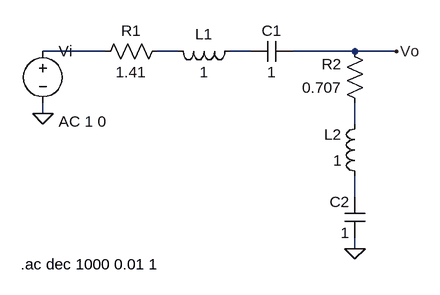
[diagram p0: schematic bandreject.asc]
bandreject.asc, the LTspice schematic file:
Version 4
SHEET 1 880 680
WIRE 16 112 -80 112
WIRE 128 112 96 112
WIRE 240 112 208 112
WIRE 400 112 304 112
WIRE 464 112 400 112
WIRE -80 208 -80 192
WIRE 400 224 400 192
WIRE 400 336 400 304
WIRE 400 416 400 400
FLAG 400 416 0
FLAG 464 112 Vo
FLAG -80 208 0
SYMBOL res 112 96 R90
WINDOW 0 0 56 VBottom 2
WINDOW 3 32 56 VTop 2
SYMATTR InstName R1
SYMATTR Value 1.41
SYMBOL ind 224 96 R90
WINDOW 0 5 56 VBottom 2
WINDOW 3 32 56 VTop 2
SYMATTR InstName L1
SYMATTR Value 1
SYMBOL cap 304 96 R90
WINDOW 0 0 32 VBottom 2
WINDOW 3 32 32 VTop 2
SYMATTR InstName C1
SYMATTR Value 1
SYMBOL res 416 208 R180
WINDOW 0 36 76 Left 2
WINDOW 3 36 40 Left 2
SYMATTR InstName R2
SYMATTR Value 0.707
SYMBOL ind 416 320 R180
WINDOW 0 36 80 Left 2
WINDOW 3 36 40 Left 2
SYMATTR InstName L2
SYMATTR Value 1
SYMBOL cap 416 400 R180
WINDOW 0 24 56 Left 2
WINDOW 3 24 8 Left 2
SYMATTR InstName C2
SYMATTR Value 1
SYMBOL voltage -80 96 R0
WINDOW 123 24 124 Left 2
WINDOW 39 0 0 Left 0
SYMATTR InstName Vi
SYMATTR Value ""
SYMATTR Value2 AC 1 0
TEXT -114 440 Left 2 !.ac dec 1000 0.01 1

The netlist it stands for:
* bandreject.asc
R1 N002 N001 1.41
L1 N003 N002 1
C1 Vo N003 1
R2 N004 Vo 0.707
L2 N005 N004 1
C2 0 N005 1
Vi N001 0 AC 1 0
.ac dec 1000 0.01 1
.backanno
.end